# Altium schematic sheet 07_Interface.SchDoc
size A4
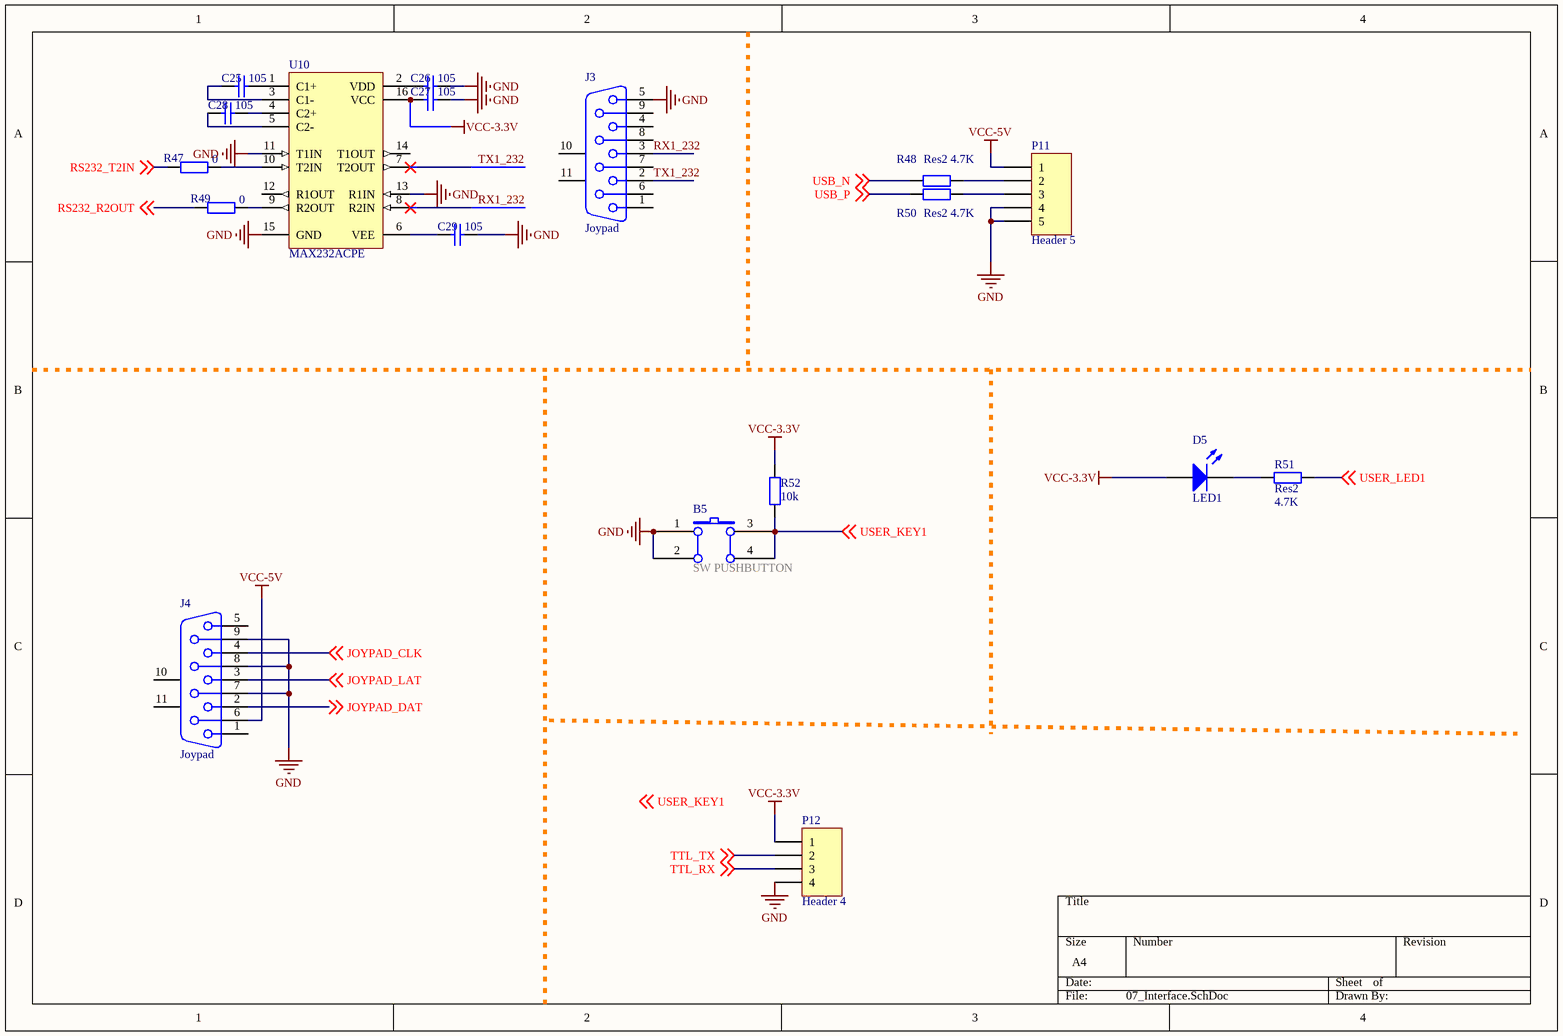
[diagram p0: 07_Interface.SchDoc]

## Parts
B5  SW PUSHBUTTON  [SWITCH-0.65/0.45]
C25  105  [RAD-0.1]
C26  105  [RAD-0.1]
C27  105  [RAD-0.1]
C28  105  [RAD-0.1]
C29  105  [RAD-0.1]
D5  LED1  [LED-R3.0]
J3  Joypad  [DSUB1.385-2H9]
J4  Joypad  [DSUB1.385-2H9]
P11  Header 5  [MICRO_USB]
P12  Header 4  [HDR1X4]
R47  0  [AXIAL-0.3]
R48  Res2  value 4.7K  [AXIAL-0.3]
R49  0  [AXIAL-0.3]
R50  Res2  value 4.7K  [AXIAL-0.3]
R51  Res2  value 4.7K  [AXIAL-0.3]
R52  10k  [AXIAL-0.3]
U10  MAX232ACPE  [SO-16_M]

## Nets
GND: B5.1(A0) B5.2(B0) C26.2 C27.2 C29.2 J3.5 J4.7 J4.8 J4.9 P11.4 P11.5 P12.4 U10.11(T1IN) U10.13(R1IN) U10.15(GND)
VCC-3.3V: C27.1 D5.1(A) P12.1 R52.2 U10.16(VCC)
VCC-5V: J4.6 P11.1
JOYPAD_CLK: J4.4 ; off-sheet JOYPAD_CLK
JOYPAD_DAT: J4.2 ; off-sheet JOYPAD_DAT
JOYPAD_LAT: J4.3 ; off-sheet JOYPAD_LAT
RS232_R2OUT: R49.1 ; off-sheet RS232_R2OUT
RS232_T2IN: R47.1 ; off-sheet RS232_T2IN
RX1_232: J3.3 U10.8(R2IN)
TTL_RX: P12.3 ; off-sheet TTL_RX
TTL_TX: P12.2 ; off-sheet TTL_TX
TX1_232: J3.2 U10.7(T2OUT)
USB_N: R48.2 ; off-sheet USB_N
USB_P: R50.2 ; off-sheet USB_P
USER_KEY1: B5.3(B1) B5.4(A1) R52.1 ; off-sheet USER_KEY1
USER_LED1: R51.1 ; off-sheet USER_LED1
NetC25_1: C25.1 U10.3(C1-)
NetC25_2: C25.2 U10.1(C1+)
NetC26_1: C26.1 U10.2(VDD)
NetC28_1: C28.1 U10.5(C2-)
NetC28_2: C28.2 U10.4(C2+)
NetC29_1: C29.1 U10.6(VEE)
NetD5_2: D5.2(K) R51.2
NetP11_2: P11.2 R48.1
NetP11_3: P11.3 R50.1
NetR47_2: R47.2 U10.10(T2IN)
NetR49_2: R49.2 U10.9(R2OUT)

Not connected (* = marked no-connect by the designer): J3 1 4 6 7 8 9 10(MH1) 11(MH2); J4 1 5 10(MH1) 11(MH2); U10 12(R1OUT) 14(T1OUT)

## Notes on the sheet
- RS232 Socket
- USB Socket
- Button
- LED
- Joypad
- TTL
- Labels drawn without touching a wire or pin: USER_KEY1

## Library data of the parts
B5 = SW PUSHBUTTON: Tactile Switch
C25-C29 = Cap: Capacitor; Value: 100pF; Published: 8-Jun-2000; LatestRevisionDate: 17-Jul-2002; LatestRevisionNote: Re-released for DXP Platform.; PackageReference: RAD-0.3; Publisher: Altium Limited
D5 = LED1: Typical RED GaAs LED; Published: 8-Jun-2000; LatestRevisionDate: 08-Jul-2005; LatestRevisionNote: Mech Layer 1 removed.; PackageReference: LED-1; Publisher: Altium Limited; PackageDescription: LED; 2 Leads
J3 J4 = D Connector 9: Receptacle Assembly, 9 Position, Right Angle; PackageDocument: O; Positions: 9; Published: 15-Jun-2001; LatestRevisionDate: 17-Jul-2002; LatestRevisionNote: Re-released for DXP Platform.; DatasheetDocument: 1-Sep-1999; PackageReference: 788750; Publisher: Altium Limited; Orientation: Right Angle; Gender: Receptacle
P11 = Header 5: Header, 5-Pin; LatestRevisionDate: 17-Jul-2002; LatestRevisionNote: Re-released for DXP Platform.; Publisher: Altium Limited
P12 = Header 4: Header, 4-Pin; LatestRevisionDate: 17-Jul-2002; LatestRevisionNote: Re-released for DXP Platform.; Publisher: Altium Limited
R47-R51 = Res2: Resistor; Published: 8-Jun-2000; LatestRevisionDate: 17-Jul-2002; LatestRevisionNote: Re-released for DXP Platform.; PackageReference: AXIAL-0.4; Publisher: Altium Limited
  R47 R49: Value: 0
  R48 R50 R51: PackageDescription: Axial Device, Thru-Hole; 2 Leads; 0.4 in Pin Spacing
R52 = Res1: 贴片电阻; Published: 8-Jun-2000; LatestRevisionDate: 17-Jul-2002; LatestRevisionNote: Re-released for DXP Platform.; PackageReference: AXIAL-0.4; Publisher: Altium Limited; Value: 10k
U10 = MAX232ACPE: +5V Powered, Multi-Channel RS-232 Driver/Receiver; PackageDocument: 1997; Published: 16-Jan-2001; LatestRevisionDate: 6-Jun-2005; LatestRevisionNote: Stylized 3D Model Added.; PackageReference: PE16A; Publisher: Altium Limited; Code_JEDEC: MS-001-BB; ComponentLink1Description: Manufacturer Link; ComponentLink1URL: http://www.maxim-ic.com/; ComponentLink2Description: Datasheet; ComponentLink2URL: http://pdfserv.maxim-ic.com/en/ds/MAX220-MAX249.pdf